# Altium project IMX6ULL开发板.PrjPCB
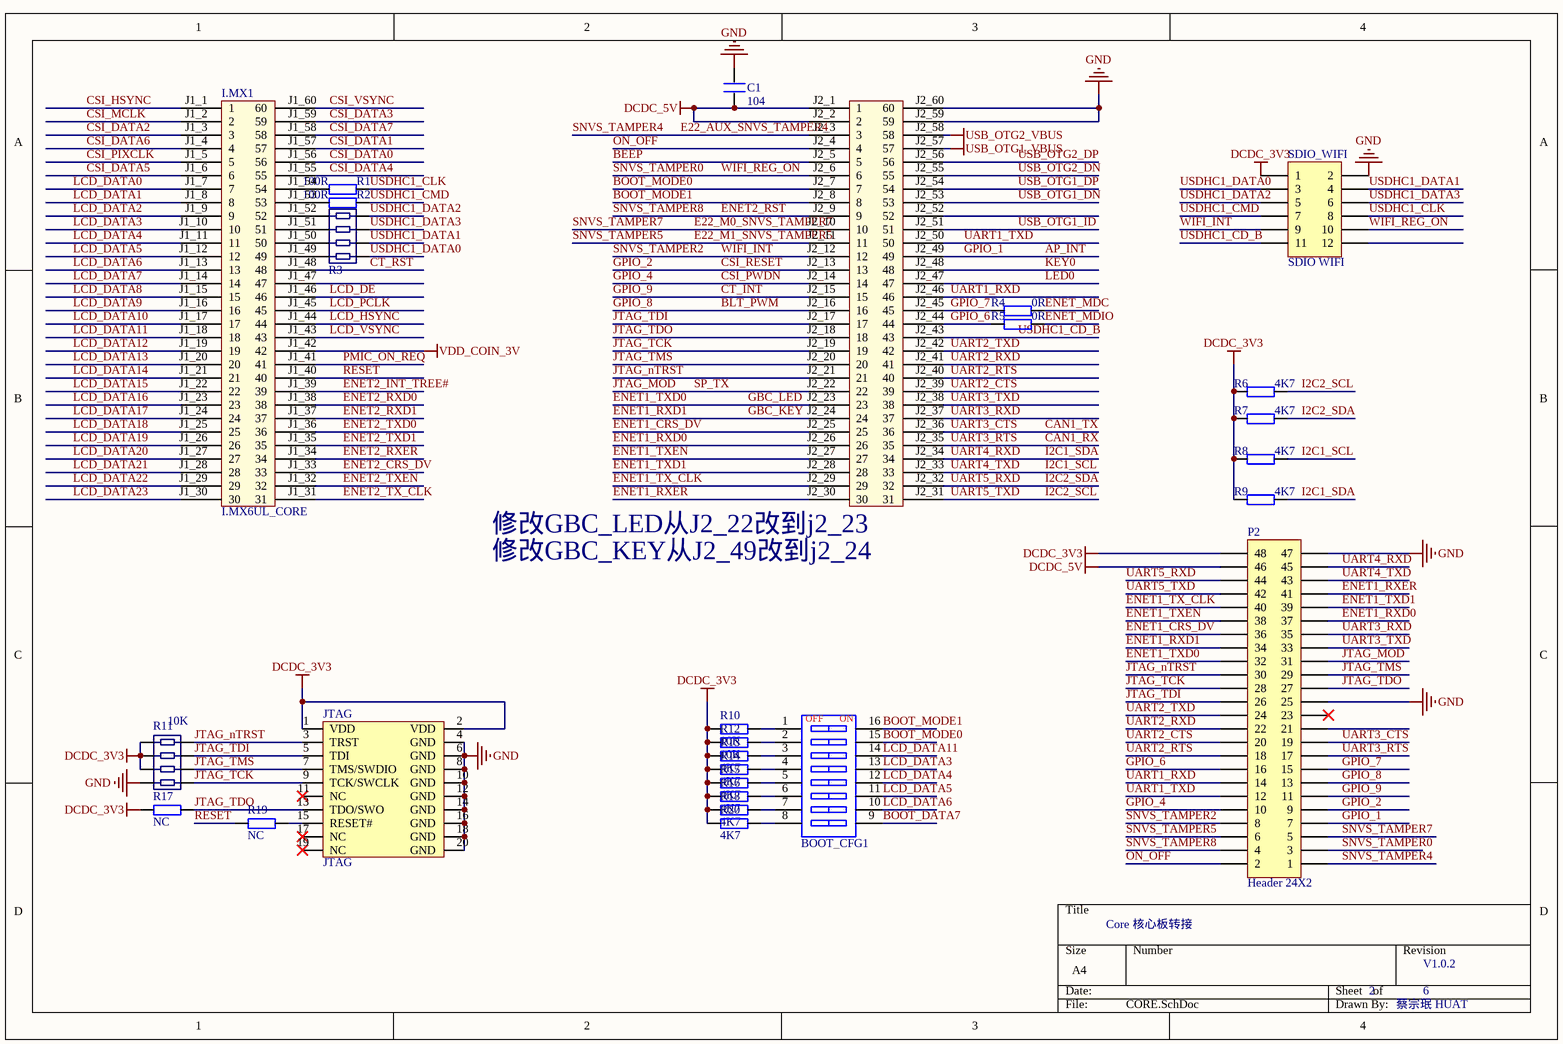
[diagram p0: CORE.SchDoc]
5 sheets, 190 parts. Net scope: global (net labels, ports and power ports of the same name join across sheets).
Board file: imx6ull开发板.PcbDoc
Sheets:
  CORE.SchDoc
  POWER.SchDoc
  DEVICE.SchDoc
  CONNECT.SchDoc
  DEVICE2.SchDoc

## Sheet CORE.SchDoc
size A4

### Parts
BOOT_CFG1  CSW-8P  [CSW DIP-8P]  (value not drawn)
C1  104  [C_0603P]
I.MX1  I.MX6UL_CORE  [I.MX6UL_CORE]
JTAG  JTAG  [JTAG_20]
P2  Header 24X2  [HDR2X24]
R1  100R  [R_0603P]
R2  100R  [R_0603P]
R3  R*4_0603_2  [R*4-0603]  (value not drawn)
R4  0R  [R_0603P]
R5  0R  [R_0603P]
R6  4K7  [R_0603P]
R7  4K7  [R_0603P]
R8  4K7  [R_0603P]
R9  4K7  [R_0603P]
R10  10K  [R_0603P]
R11  10K  [R*4-0603]
R12  10K  [R_0603P]
R13  4K7  [R_0603P]
R14  4K7  [R_0603P]
R15  4K7  [R_0603P]
R16  4K7  [R_0603P]
R17  NC  [R_0603P]
R18  4K7  [R_0603P]
R19  NC  [R_0603P]
R20  4K7  [R_0603P]
SDIO_WIFI  SDIO WIFI  [HDR2X6]

### Nets
DCDC_3V3: JTAG.1(VDD) JTAG.2(VDD) P2.48 R6.1 R7.1 R8.1 R9.1 R10.1 R11.1 R11.3 R11.5 R12.1 R13.1 R14.1 R15.1 R16.1 R17.1 R18.1 R20.1 SDIO_WIFI.1
DCDC_5V: C1.1 I.MX1.J2_1(1) I.MX1.J2_2(2) P2.46
GND: C1.2 I.MX1.J2_59(59) I.MX1.J2_60(60) JTAG.4(GND) JTAG.6(GND) JTAG.8(GND) JTAG.10(GND) JTAG.12(GND) JTAG.14(GND) JTAG.16(GND) JTAG.18(GND) JTAG.20(GND) P2.25 P2.47 R11.7 SDIO_WIFI.2
USB_OTG1_VBUS: I.MX1.J2_57(57)
USB_OTG2_VBUS: I.MX1.J2_58(58)
VDD_COIN_3V: I.MX1.J1_42(42)
AP_INT: I.MX1.J2_49(49) P2.7  [also labelled GPIO_1]
BEEP: I.MX1.J2_5(5)
BLT_PWM: I.MX1.J2_16(16) P2.13  [also labelled GPIO_8]
BOOT_DATA7: BOOT_CFG1.9
BOOT_MODE0: BOOT_CFG1.15 I.MX1.J2_7(7)
BOOT_MODE1: BOOT_CFG1.16 I.MX1.J2_8(8)
CAN1_RX: I.MX1.J2_35(35) P2.17  [also labelled UART3_RTS]
CAN1_TX: I.MX1.J2_36(36) P2.19  [also labelled UART3_CTS]
CSI_DATA0: I.MX1.J1_56(56)
CSI_DATA1: I.MX1.J1_57(57)
CSI_DATA2: I.MX1.J1_3(3)
CSI_DATA3: I.MX1.J1_59(59)
CSI_DATA4: I.MX1.J1_55(55)
CSI_DATA5: I.MX1.J1_6(6)
CSI_DATA6: I.MX1.J1_4(4)
CSI_DATA7: I.MX1.J1_58(58)
CSI_HSYNC: I.MX1.J1_1(1)
CSI_MCLK: I.MX1.J1_2(2)
CSI_PIXCLK: I.MX1.J1_5(5)
CSI_PWDN: I.MX1.J2_14(14) P2.10  [also labelled GPIO_4]
CSI_RESET: I.MX1.J2_13(13) P2.9  [also labelled GPIO_2]
CSI_VSYNC: I.MX1.J1_60(60)
CT_INT: I.MX1.J2_15(15) P2.11  [also labelled GPIO_9]
CT_RST: I.MX1.J1_48(48)
E22_AUX_SNVS_TAMPER4: I.MX1.J2_3(3) P2.1  [also labelled SNVS_TAMPER4]
E22_M0_SNVS_TAMPER7: I.MX1.J2_10(10) P2.5  [also labelled SNVS_TAMPER7]
E22_M1_SNVS_TAMPER5: I.MX1.J2_11(11) P2.6  [also labelled SNVS_TAMPER5]
ENET1_CRS_DV: I.MX1.J2_25(25) P2.36
ENET1_RXD0: I.MX1.J2_26(26) P2.37
ENET1_RXD1: I.MX1.J2_24(24) P2.34  [also labelled GBC_KEY]
ENET1_RXER: I.MX1.J2_30(30) P2.41
ENET1_TX_CLK: I.MX1.J2_29(29) P2.40
ENET1_TXD0: I.MX1.J2_23(23) P2.32  [also labelled GBC_LED]
ENET1_TXD1: I.MX1.J2_28(28) P2.39
ENET1_TXEN: I.MX1.J2_27(27) P2.38
ENET2_CRS_DV: I.MX1.J1_33(33)
ENET2_INT_TREE#: I.MX1.J1_39(39)
ENET2_RST: I.MX1.J2_9(9) P2.4  [also labelled SNVS_TAMPER8]
ENET2_RXD0: I.MX1.J1_38(38)
ENET2_RXD1: I.MX1.J1_37(37)
ENET2_RXER: I.MX1.J1_34(34)
ENET2_TX_CLK: I.MX1.J1_31(31)
ENET2_TXD0: I.MX1.J1_36(36)
ENET2_TXD1: I.MX1.J1_35(35)
ENET2_TXEN: I.MX1.J1_32(32)
ENET_MDC: R4.2
ENET_MDIO: R5.2
GPIO_6: I.MX1.J2_44(44) P2.16 R5.1
GPIO_7: I.MX1.J2_45(45) P2.15 R4.1
I2C1_SCL: I.MX1.J2_33(33) P2.43 R8.2  [also labelled UART4_TXD]
I2C1_SDA: I.MX1.J2_34(34) P2.45 R9.2  [also labelled UART4_RXD]
I2C2_SCL: I.MX1.J2_31(31) P2.42 R6.2  [also labelled UART5_TXD]
I2C2_SDA: I.MX1.J2_32(32) P2.44 R7.2  [also labelled UART5_RXD]
JTAG_MOD: I.MX1.J2_22(22) P2.31  [also labelled SP_TX]
JTAG_nTRST: I.MX1.J2_21(21) JTAG.3(TRST) P2.30 R11.2
JTAG_TCK: I.MX1.J2_19(19) JTAG.9(TCK/SWCLK) P2.28 R11.8
JTAG_TDI: I.MX1.J2_17(17) JTAG.5(TDI) P2.26 R11.4
JTAG_TDO: I.MX1.J2_18(18) JTAG.13(TDO/SWO) P2.27 R17.2
JTAG_TMS: I.MX1.J2_20(20) JTAG.7(TMS/SWDIO) P2.29 R11.6
KEY0: I.MX1.J2_48(48)
LCD_DATA0: I.MX1.J1_7(7)  [project net LCD_B0]
LCD_DATA1: I.MX1.J1_8(8)  [project net LCD_B1]
LCD_DATA2: I.MX1.J1_9(9)  [project net LCD_B2]
LCD_DATA3: BOOT_CFG1.13 I.MX1.J1_10(10)  [project net LCD_B3]
LCD_DATA4: BOOT_CFG1.12 I.MX1.J1_11(11)  [project net LCD_B4]
LCD_DATA5: BOOT_CFG1.11 I.MX1.J1_12(12)  [project net LCD_B5]
LCD_DATA6: BOOT_CFG1.10 I.MX1.J1_13(13)  [project net LCD_B6]
LCD_DATA7: I.MX1.J1_14(14)
LCD_DATA8: I.MX1.J1_15(15)
LCD_DATA9: I.MX1.J1_16(16)
LCD_DATA10: I.MX1.J1_17(17)
LCD_DATA11: BOOT_CFG1.14 I.MX1.J1_18(18)
LCD_DATA12: I.MX1.J1_19(19)
LCD_DATA13: I.MX1.J1_20(20)
LCD_DATA14: I.MX1.J1_21(21)
LCD_DATA15: I.MX1.J1_22(22)
LCD_DATA16: I.MX1.J1_23(23)
LCD_DATA17: I.MX1.J1_24(24)
LCD_DATA18: I.MX1.J1_25(25)
LCD_DATA19: I.MX1.J1_26(26)
LCD_DATA20: I.MX1.J1_27(27)
LCD_DATA21: I.MX1.J1_28(28)
LCD_DATA22: I.MX1.J1_29(29)
LCD_DATA23: I.MX1.J1_30(30)
LCD_DE: I.MX1.J1_46(46)
LCD_HSYNC: I.MX1.J1_44(44)
LCD_PCLK: I.MX1.J1_45(45)
LCD_VSYNC: I.MX1.J1_43(43)
LED0: I.MX1.J2_47(47)
ON_OFF: I.MX1.J2_4(4) P2.2
PMIC_ON_REQ: I.MX1.J1_41(41)
RESET: I.MX1.J1_40(40) R19.1
SNVS_TAMPER0: I.MX1.J2_6(6) P2.3 SDIO_WIFI.10  [also labelled WIFI_REG_ON]
SNVS_TAMPER2: I.MX1.J2_12(12) P2.8 SDIO_WIFI.9  [also labelled WIFI_INT]
UART1_RXD: I.MX1.J2_46(46) P2.14
UART1_TXD: I.MX1.J2_50(50) P2.12
UART2_CTS: I.MX1.J2_39(39) P2.20
UART2_RTS: I.MX1.J2_40(40) P2.18
UART2_RXD: I.MX1.J2_41(41) P2.22
UART2_TXD: I.MX1.J2_42(42) P2.24
UART3_RXD: I.MX1.J2_37(37) P2.35
UART3_TXD: I.MX1.J2_38(38) P2.33
USB_OTG1_DN: I.MX1.J2_53(53)
USB_OTG1_DP: I.MX1.J2_54(54)
USB_OTG1_ID: I.MX1.J2_51(51)
USB_OTG2_DN: I.MX1.J2_55(55)
USB_OTG2_DP: I.MX1.J2_56(56)
USDHC1_CD_B: I.MX1.J2_43(43) SDIO_WIFI.11
USDHC1_CLK: R1.2 SDIO_WIFI.8
USDHC1_CMD: R2.2 SDIO_WIFI.7
USDHC1_DATA0: R3.8 SDIO_WIFI.3
USDHC1_DATA1: R3.6 SDIO_WIFI.4
USDHC1_DATA2: R3.2 SDIO_WIFI.5
USDHC1_DATA3: R3.4 SDIO_WIFI.6
NetBOOT_CFG1_1: BOOT_CFG1.1 R10.2
NetBOOT_CFG1_2: BOOT_CFG1.2 R12.2
NetBOOT_CFG1_3: BOOT_CFG1.3 R13.2
NetBOOT_CFG1_4: BOOT_CFG1.4 R14.2
NetBOOT_CFG1_5: BOOT_CFG1.5 R15.2
NetBOOT_CFG1_6: BOOT_CFG1.6 R16.2
NetBOOT_CFG1_7: BOOT_CFG1.7 R18.2
NetBOOT_CFG1_8: BOOT_CFG1.8 R20.2
NetI.MX1_J1_49: I.MX1.J1_49(49) R3.7
NetI.MX1_J1_50: I.MX1.J1_50(50) R3.5
NetI.MX1_J1_51: I.MX1.J1_51(51) R3.3
NetI.MX1_J1_52: I.MX1.J1_52(52) R3.1
NetI.MX1_J1_53: I.MX1.J1_53(53) R2.1
NetI.MX1_J1_54: I.MX1.J1_54(54) R1.1
NetJTAG_15: JTAG.15(RESET#) R19.2

Not connected (* = marked no-connect by the designer): I.MX1 J1_47(47) J2_52(52); JTAG 11(NC)* 17(NC)* 19(NC)*; P2 21 23*; SDIO_WIFI 12

### Notes on the sheet
- (near I.MX1) 修改GBC_LED从J2_22改到j2_23
- (near I.MX1) 修改GBC_KEY从J2_49改到j2_24
- Core 核心板转接
- 2
- 6
- V1.0.2
- 蔡宗珉 HUAT
- (in symbol CSW-8P) OFF; ON

### Library data of the parts
BOOT_CFG1 = CSW-8P: 8路编码开关; 版权归属: 源创客; BOM名称: 8路编码开关; 学习资源: www.ooocke.com
C1 = C
I.MX1 = I.MX6UL核心板
P2 = Header 24X2: Header, 24-Pin, Dual row; LatestRevisionDate: 17-Jul-2002; LatestRevisionNote: Re-released for DXP Platform.; Publisher: Altium Limited
R1 R2 R4-R10 R12-R20 = R
R11 = R*4_0603_2
SDIO_WIFI = Header 6X2: Header, 6-Pin, Dual row; LatestRevisionDate: 17-Jul-2002; LatestRevisionNote: Re-released for DXP Platform.; Publisher: Altium Limited

## Sheet POWER.SchDoc
size A4
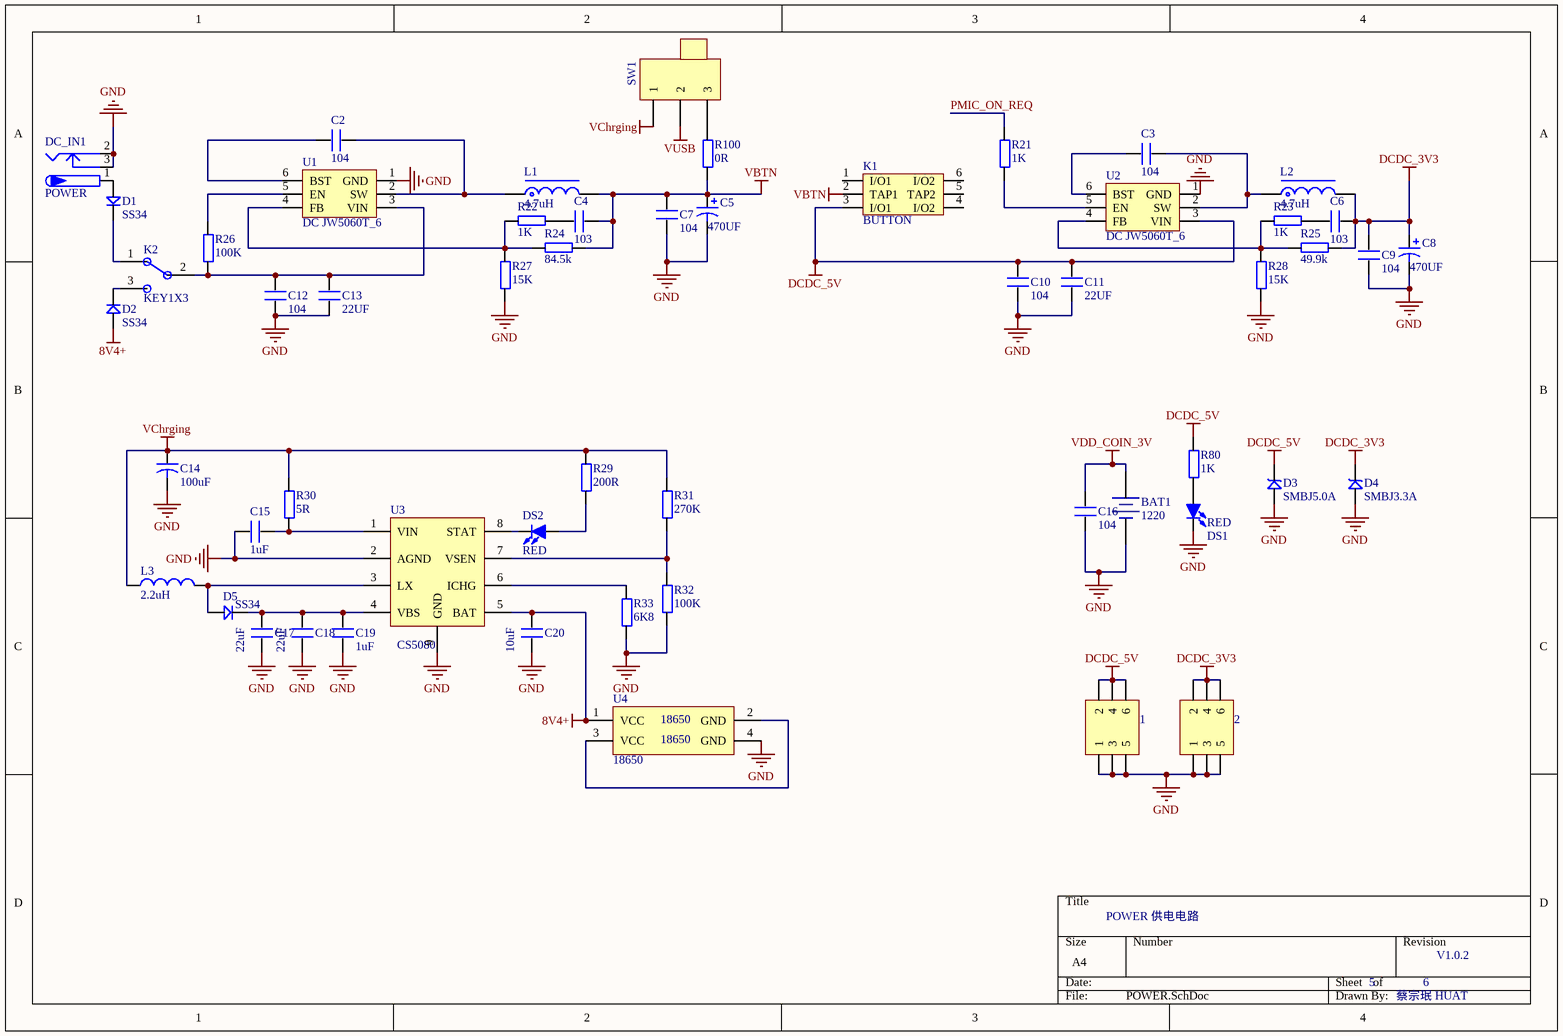
[diagram p1: POWER.SchDoc]

### Parts
1  RS232/RS485  [HDR-3X2]  (value not drawn)
2  RS232/RS485  [HDR-3X2]  (value not drawn)
BAT1  1220  [CR1220_B]
C2  104  [C_0603P]
C3  104  [C_0603P]
C4  103  [C_0603P]
C5  value 470UF  [CAP2.54M]  (hidden comment: Cap Pol1)
C6  103  [C_0603P]
C7  104  [C_0603P]
C8  value 470UF  [CAP2.54M]  (hidden comment: Cap Pol1)
C9  104  [C_0603P]
C10  104  [C_0603P]
C11  22UF  [C_0603P]
C12  104  [C_0603P]
C13  22UF  [C_0603P]
C14  value 100uF  [CAP2.54M]  (hidden comment: Cap2)
C15  1uF  [C_0603P]
C16  104  [C_0603P]
C17  22uF  [C_0603P]
C18  22uF  [C_0603P]
C19  1uF  [C_0603P]
C20  10uF  [C_0805]
D1  SS34  [DIODE 3*5.3]
D2  SS34  [DIODE 3*5.3]
D3  SMBJ5.0A  [SMBJ]
D4  SMBJ3.3A  [SMBJ]
D5  SS34  [DIODE 3*5.3]
DC_IN1  POWER  [DC10B]
DS1  RED  [LED 0805R]
DS2  RED  [LED 0805R]
K1  BUTTON  [BTN8.5*8.5]
K2  KEY1X3  [PKEY]
L1  4.7uH  [L-SMD-0420]
L2  4.7uH  [L-SMD-0420]
L3  2.2uH  [CD74 电感   7*7*4mm贴片]
R21  1K  [R_0603P]
R22  1K  [R_0603P]
R23  1K  [R_0603P]
R24  84.5k  [R_0603P]
R25  49.9k  [R_0603P]
R26  100K  [R_0603P]
R27  15K  [R_0603P]
R28  15K  [R_0603P]
R29  200R  [R_0603P]
R30  5R  [R_0805]
R31  270K  [R_0603P]
R32  100K  [R_0603P]
R33  6K8  [R_0603P]
R80  1K  [R_0603P]
R100  0R  [R_0805]
SW1  switch  [三脚拨动开关SS12D00G4]  (value not drawn)
U1  DC JW5060T_6  [SOT23-6N]
U2  DC JW5060T_6  [SOT23-6N]
U3  CS5080  [ESOP8   IP5306]
U4  18650  [18650 2节电池座 PCB插脚]

### Nets
8V4+: C20.2 D2.1 U3.5(BAT) U4.1(VCC)
DCDC_3V3: 2.2 2.4 2.6 C6.1 C8.1 C9.2 D4.2 L2.2 R25.1
DCDC_5V: 1.2 1.4 1.6 C10.2 C11.2 D3.2 K1.3(I/O1) R80.2 U2.3(VIN)
GND: 1.1 1.3 1.5 2.1 2.3 2.5 BAT1.2(DC-) C5.2 C7.1 C8.2 C9.1 C10.1 C11.1 C12.1 C13.1 C14.2 C15.1 C16.1 C17.1 C18.1 C19.1 C20.1 D3.1 D4.1 DC_IN1.2 DC_IN1.3 DS1.2(K) R27.1 R28.1 R32.1 R33.1 U1.1(GND) U2.1(GND) U3.2(AGND) U3.9(GND) U4.4(GND)
VBTN: C4.1 C5.1 C7.2 K1.2(TAP1) L1.2 R24.1 R100.1
VChrging: C14.1 L3.1 R29.2 R30.2 R31.2 SW1.1
VDD_COIN_3V: BAT1.1(DC+) C16.2
VUSB: SW1.2
PMIC_ON_REQ: R21.2
NetC2_1: C2.1 U1.6(BST)
NetC2_2: C2.2 L1.1 U1.2(SW)
NetC3_1: C3.1 U2.6(BST)
NetC3_2: C3.2 L2.1 U2.2(SW)
NetC4_2: C4.2 R22.1
NetC6_2: C6.2 R23.1
NetC12_2: C12.2 C13.2 K2.2 R26.1 U1.3(VIN)
NetC15_2: C15.2 R30.1 U3.1(VIN)
NetC17_2: C17.2 C18.2 C19.2 D5.2 U3.4(VBS)
NetD1_1: D1.1 DC_IN1.1
NetD1_2: D1.2 K2.1
NetD2_2: D2.2 K2.3
NetD5_1: D5.1 L3.2 U3.3(LX)
NetDS1_1: DS1.1(A) R80.1
NetDS2_1: DS2.1(A) R29.1
NetDS2_2: DS2.2(K) U3.8(STAT)
NetR21_1: R21.1 U2.5(EN)
NetR22_2: R22.2 R24.2 R27.2 U1.4(FB)
NetR23_2: R23.2 R25.2 R28.2 U2.4(FB)
NetR26_2: R26.2 U1.5(EN)
NetR31_1: R31.1 R32.2 U3.7(VSEN)
NetR33_2: R33.2 U3.6(ICHG)
NetR100_2: R100.2 SW1.3
NetU4_2: U4.2(GND) U4.3(VCC)

Not connected (* = marked no-connect by the designer): K1 1(I/O1) 4(I/O2) 5(TAP2) 6(I/O2)

### Notes on the sheet
- POWER 供电电路
- 5
- 6
- V1.0.2
- 蔡宗珉 HUAT

### Library data of the parts
1 2 = Header 3X2: 3*2P接插件; 版权归属: 源创客; BOM名称: 3*2P接插件; 学习资源: www.ooocke.com
BAT1 = CR-3V: 微型电池; 版权归属: 源创客; BOM名称: 微型电池; 学习资源: www.ooocke.com
C2-C4 C6 C7 C9-C13 C15-C20 = C
C5 C8 = Cap Pol1: Polarized Capacitor (Radial); Published: 8-Jun-2000; LatestRevisionDate: 17-Jul-2002; LatestRevisionNote: Re-released for DXP Platform.; PackageReference: RB7.6-15; Publisher: Altium Limited; PackageDescription: Polarized Capacitor (Radial); 2 Leads
C14 = Cap2: Capacitor; Published: 23-Sep-2002; PackageReference: CAPR5-4X5; Publisher: Altium Limited; PackageDescription: Capacitor; 2 Leads
D1 D2 D5 = D: 1N4148
D3 D4 = SMBJ: TVS
DC_IN1 = P-DC: 低压电源接口; BOM名称: DC电源接口; 版权归属: 源创客; 学习资源: www.ooocke.com
DS1 DS2 = LED-SMD: 贴片LED; 版权归属: 源创客; BOM名称: 贴片LED; 学习资源: www.ooocke.com
K2 = PKEY
L1 L2 = L-CDRH: 功率屏蔽电感; 版权归属: 源创客; BOM名称: 功率屏蔽电感; 学习资源: www.ooocke.com
L3 = Inductor: Code_IEC: 1005; Published: 8-Jun-2000; LatestRevisionDate: 17-Jul-2002; LatestRevisionNote: Re-released for DXP Platform.; PackageReference: 0402-A; Publisher: Altium Limited; Code_JEITA: 0402
R21-R33 R80 R100 = R
SW1 = 3脚拔动开关
U1 U2 = DC JW5060T_6: DC降压芯片
U3 = CS5080 5V输入8V4输出充电器IC: 5V输入8V4输出充电器IC
U4 = 18650 2节电池座 PCB插脚

## Sheet DEVICE.SchDoc
size A4
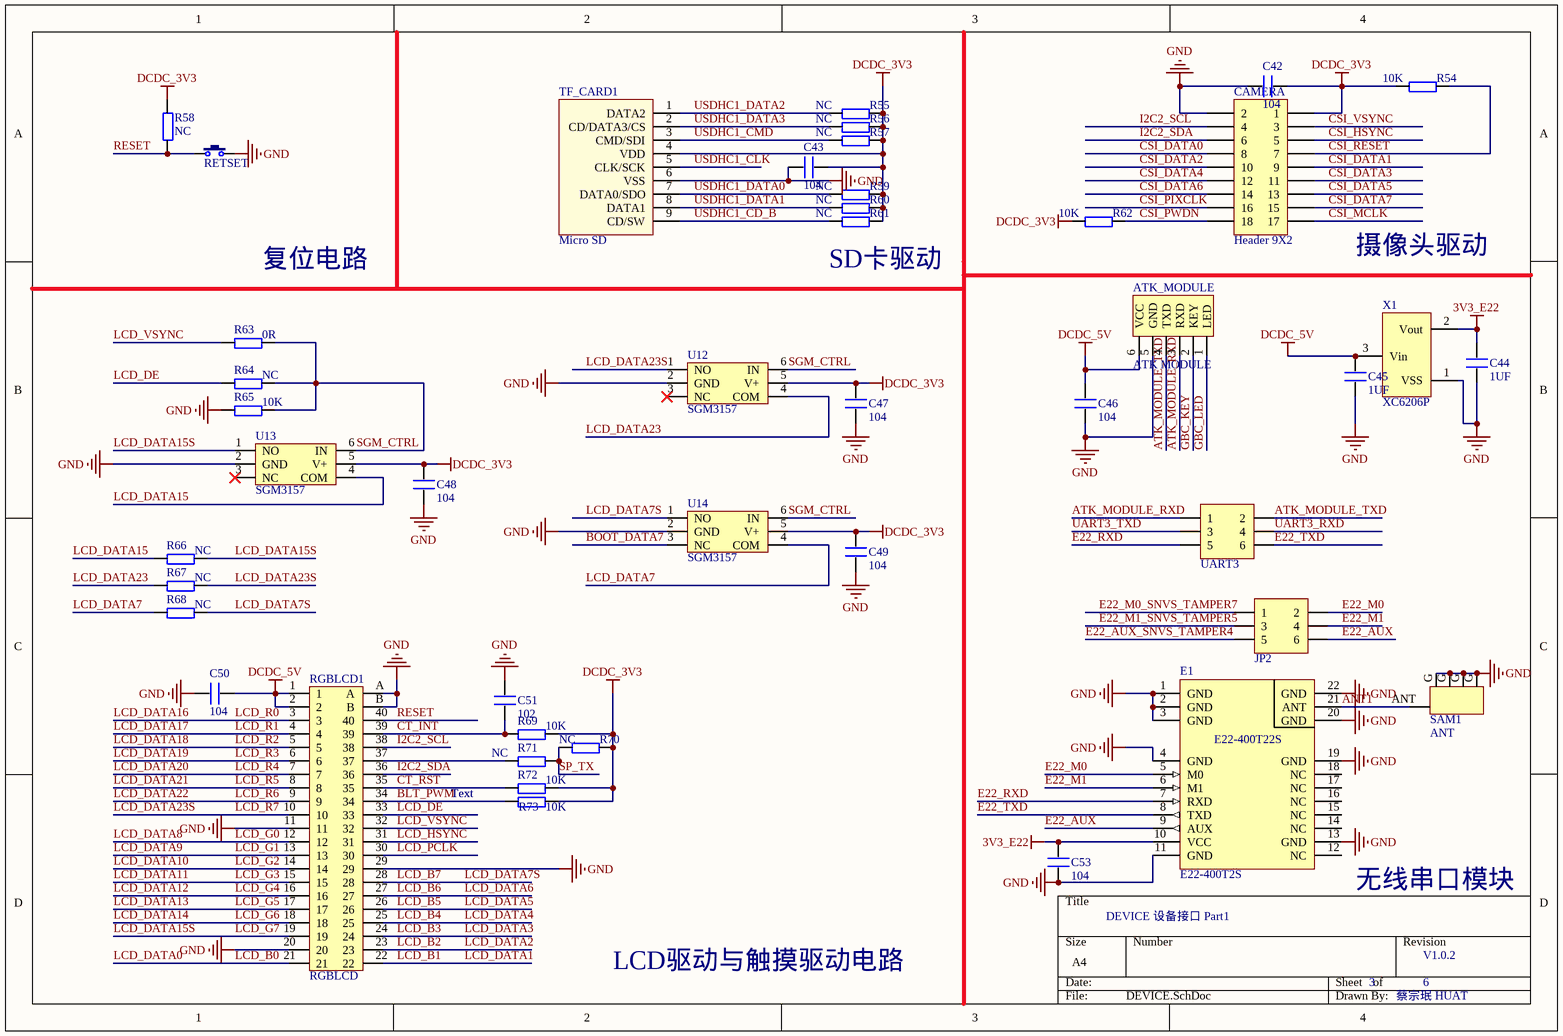
[diagram p2: DEVICE.SchDoc]

### Parts
ATK_MODULE  ATK MODULE  [HEAD6]
C42  104  [C_0603P]
C43  104  [C_0603P]
C44  1UF  [C_0603P]
C45  1UF  [C_0603P]
C46  104  [C_0603P]
C47  104  [C_0603P]
C48  104  [C_0603P]
C49  104  [C_0603P]
C50  104  [C_0603P]
C51  102  [C_0603P]
C53  104  [C_0603P]
CAMERA  Header 9X2  [HDR2X9]
E1  E22-400T2S  [PE22-400T22S]
JP2  RS232/RS485  [HDR-3X2]  (value not drawn)
R54  10K  [R_0603P]
R55  NC  [R_0603P]
R56  NC  [R_0603P]
R57  NC  [R_0603P]
R58  NC  [R_0603P]
R59  NC  [R_0603P]
R60  NC  [R_0603P]
R61  NC  [R_0603P]
R62  10K  [R_0603P]
R63  0R  [R_0603P]
R64  NC  [R_0603P]
R65  10K  [R_0603P]
R66  NC  [R_0603P]
R67  NC  [R_0603P]
R68  NC  [R_0603P]
R69  10K  [R_0603P]
R70  NC  [R_0603P]
R71  NC  [R_0603P]
R72  10K  [R_0603P]
R73  10K  [R_0603P]
RETSET  KEY  [TSW DIP-6*6*5 - 2]  (value not drawn)
RGBLCD1  RGBLCD  [FPC0.5-TOP40P]
SAM1  ANT  [SMA-KE]
TF_CARD1  Micro SD  [Micro SD]
U12  SGM3157  [SOT363-6L]
U13  SGM3157  [SOT363-6L]
U14  SGM3157  [SOT363-6L]
UART3  RS232/RS485  [HDR-3X2]  (value not drawn)
X1  XC6206P  [XC6206P332  SOT-23  LDO电源稳压IC]

### Nets
3V3_E22: C44.2 C53.2 E1.10(VCC) X1.2(Vout)
DCDC_3V3: C42.2 C43.2 C47.2 C48.2 C49.2 CAMERA.1 R54.1 R55.2 R56.2 R57.2 R58.2 R59.2 R60.2 R61.2 R62.1 R69.2 R70.2 R72.2 R73.2 TF_CARD1.4(VDD) U12.5(V+) U13.5(V+) U14.5(V+)
DCDC_5V: ATK_MODULE.6(VCC) C45.2 C46.2 C50.2 RGBLCD1.1 RGBLCD1.2 X1.3(Vin)
GND: ATK_MODULE.5(GND) C42.1 C43.1 C44.1 C45.1 C46.1 C47.1 C48.1 C49.1 C50.1 C51.2 C53.1 CAMERA.2 E1.1(GND) E1.2(GND) E1.3(GND) E1.4(GND) E1.11(GND) E1.13(GND) E1.19(GND) E1.20(GND) E1.22(GND) R65.1 RETSET.2 RGBLCD1.11 RGBLCD1.20 RGBLCD1.29 RGBLCD1.A RGBLCD1.B SAM1.G TF_CARD1.6(VSS) U12.2(GND) U13.2(GND) U14.2(GND) X1.1(VSS)
ANT1: E1.21(ANT) SAM1.ANT
ATK_MODULE_RXD: ATK_MODULE.3(RXD) UART3.1
ATK_MODULE_TXD: ATK_MODULE.4(TXD) UART3.2
BLT_PWM: R73.1 RGBLCD1.34
BOOT_DATA7: U14.3(NC)
CSI_DATA0: CAMERA.8
CSI_DATA1: CAMERA.9
CSI_DATA2: CAMERA.10
CSI_DATA3: CAMERA.11
CSI_DATA4: CAMERA.12
CSI_DATA5: CAMERA.13
CSI_DATA6: CAMERA.14
CSI_DATA7: CAMERA.15
CSI_HSYNC: CAMERA.5
CSI_MCLK: CAMERA.17
CSI_PIXCLK: CAMERA.16
CSI_PWDN: CAMERA.18 R62.2
CSI_RESET: CAMERA.7 R54.2
CSI_VSYNC: CAMERA.3
CT_INT: C51.1 R69.1 RGBLCD1.39
CT_RST: R72.1 RGBLCD1.35
E22_AUX: E1.9(AUX) JP2.6
E22_AUX_SNVS_TAMPER4: JP2.5
E22_M0: E1.5(M0) JP2.2
E22_M0_SNVS_TAMPER7: JP2.1
E22_M1: E1.6(M1) JP2.4
E22_M1_SNVS_TAMPER5: JP2.3
E22_RXD: E1.7(RXD) UART3.5
E22_TXD: E1.8(TXD) UART3.6
GBC_KEY: ATK_MODULE.2(KEY)  [project net ENET1_RXD1]
GBC_LED: ATK_MODULE.1(LED)  [project net ENET1_TXD0]
I2C2_SCL: CAMERA.4 RGBLCD1.38
I2C2_SDA: CAMERA.6 RGBLCD1.36
LCD_B0: RGBLCD1.21  [also labelled LCD_DATA0]
LCD_B1: RGBLCD1.22  [also labelled LCD_DATA1]
LCD_B2: RGBLCD1.23  [also labelled LCD_DATA2]
LCD_B3: RGBLCD1.24  [also labelled LCD_DATA3]
LCD_B4: RGBLCD1.25  [also labelled LCD_DATA4]
LCD_B5: RGBLCD1.26  [also labelled LCD_DATA5]
LCD_B6: RGBLCD1.27  [also labelled LCD_DATA6]
LCD_B7: R68.2 RGBLCD1.28 U14.1(NO)  [also labelled LCD_DATA7S]
LCD_DATA7: R68.1 U14.4(COM)
LCD_DATA8: RGBLCD1.12  [also labelled LCD_G0]
LCD_DATA9: RGBLCD1.13  [also labelled LCD_G1]
LCD_DATA10: RGBLCD1.14  [also labelled LCD_G2]
LCD_DATA11: RGBLCD1.15  [also labelled LCD_G3]
LCD_DATA12: RGBLCD1.16  [also labelled LCD_G4]
LCD_DATA13: RGBLCD1.17  [also labelled LCD_G5]
LCD_DATA14: RGBLCD1.18  [also labelled LCD_G6]
LCD_DATA15: R66.1 U13.4(COM)
LCD_DATA15S: R66.2 RGBLCD1.19 U13.1(NO)  [also labelled LCD_G7]
LCD_DATA16: RGBLCD1.3  [also labelled LCD_R0]
LCD_DATA17: RGBLCD1.4  [also labelled LCD_R1]
LCD_DATA18: RGBLCD1.5  [also labelled LCD_R2]
LCD_DATA19: RGBLCD1.6  [also labelled LCD_R3]
LCD_DATA20: RGBLCD1.7  [also labelled LCD_R4]
LCD_DATA21: RGBLCD1.8  [also labelled LCD_R5]
LCD_DATA22: RGBLCD1.9  [also labelled LCD_R6]
LCD_DATA23: R67.1 U12.4(COM)
LCD_DATA23S: R67.2 RGBLCD1.10 U12.1(NO)  [also labelled LCD_R7]
LCD_DE: R64.1 RGBLCD1.33
LCD_HSYNC: RGBLCD1.31
LCD_PCLK: RGBLCD1.30
LCD_VSYNC: R63.1 RGBLCD1.32
RESET: R58.1 RETSET.1 RGBLCD1.40
SGM_CTRL: R63.2 R64.2 R65.2 U12.6(IN) U13.6(IN) U14.6(IN)
SP_TX: R70.1 R71.2  [project net JTAG_MOD]
UART3_RXD: UART3.4
UART3_TXD: UART3.3
USDHC1_CD_B: R61.1 TF_CARD1.9(CD/SW)
USDHC1_CLK: TF_CARD1.5(CLK/SCK)
USDHC1_CMD: R57.1 TF_CARD1.3(CMD/SDI)
USDHC1_DATA0: R59.1 TF_CARD1.7(DATA0/SDO)
USDHC1_DATA1: R60.1 TF_CARD1.8(DATA1)
USDHC1_DATA2: R55.1 TF_CARD1.1(DATA2)
USDHC1_DATA3: R56.1 TF_CARD1.2(CD/DATA3/CS)
NetR71_1: R71.1 RGBLCD1.37

Not connected (* = marked no-connect by the designer): E1 12(NC) 14(NC) 15(NC) 16(NC) 17(NC) 18(NC); U12 3(NC)*; U13 3(NC)*

### Notes on the sheet
- 复位电路
- SD卡驱动
- 摄像头驱动
- Text
- DEVICE 设备接口 Part1
- (near E1) 无线串口模块
- LCD驱动与触摸驱动电路
- 3
- 6
- V1.0.2
- 蔡宗珉 HUAT
- (in symbol E22-400T2S) E22-400T22S

### Library data of the parts
ATK_MODULE = ATK-HC05
C42-C51 C53 = C
CAMERA = Header 9X2: Header, 9-Pin, Dual row; LatestRevisionDate: 17-Jul-2002; LatestRevisionNote: Re-released for DXP Platform.; Publisher: Altium Limited
JP2 UART3 = Header 3X2: 3*2P接插件; 版权归属: 源创客; BOM名称: 3*2P接插件; 学习资源: www.ooocke.com
R54-R73 = R
RETSET = KEY: 按键; BOM名称: 3x6轻触开关; 版权归属: 源创客; 学习资源: www.ooocke.com
RGBLCD1 = FPC-40: FPC-40P-0.5mm
SAM1 = SAM-DIP 天线座
TF_CARD1 = Micro SD: Micro SD卡; 版权归属: 源创客; BOM名称: Micro SD卡; 学习资源: www.ooocke.com
U12-U14 = SGM3157: 单路双掷模拟开关
X1 = XC6206P-332 稳压LDO芯片

## Sheet CONNECT.SchDoc
size A4
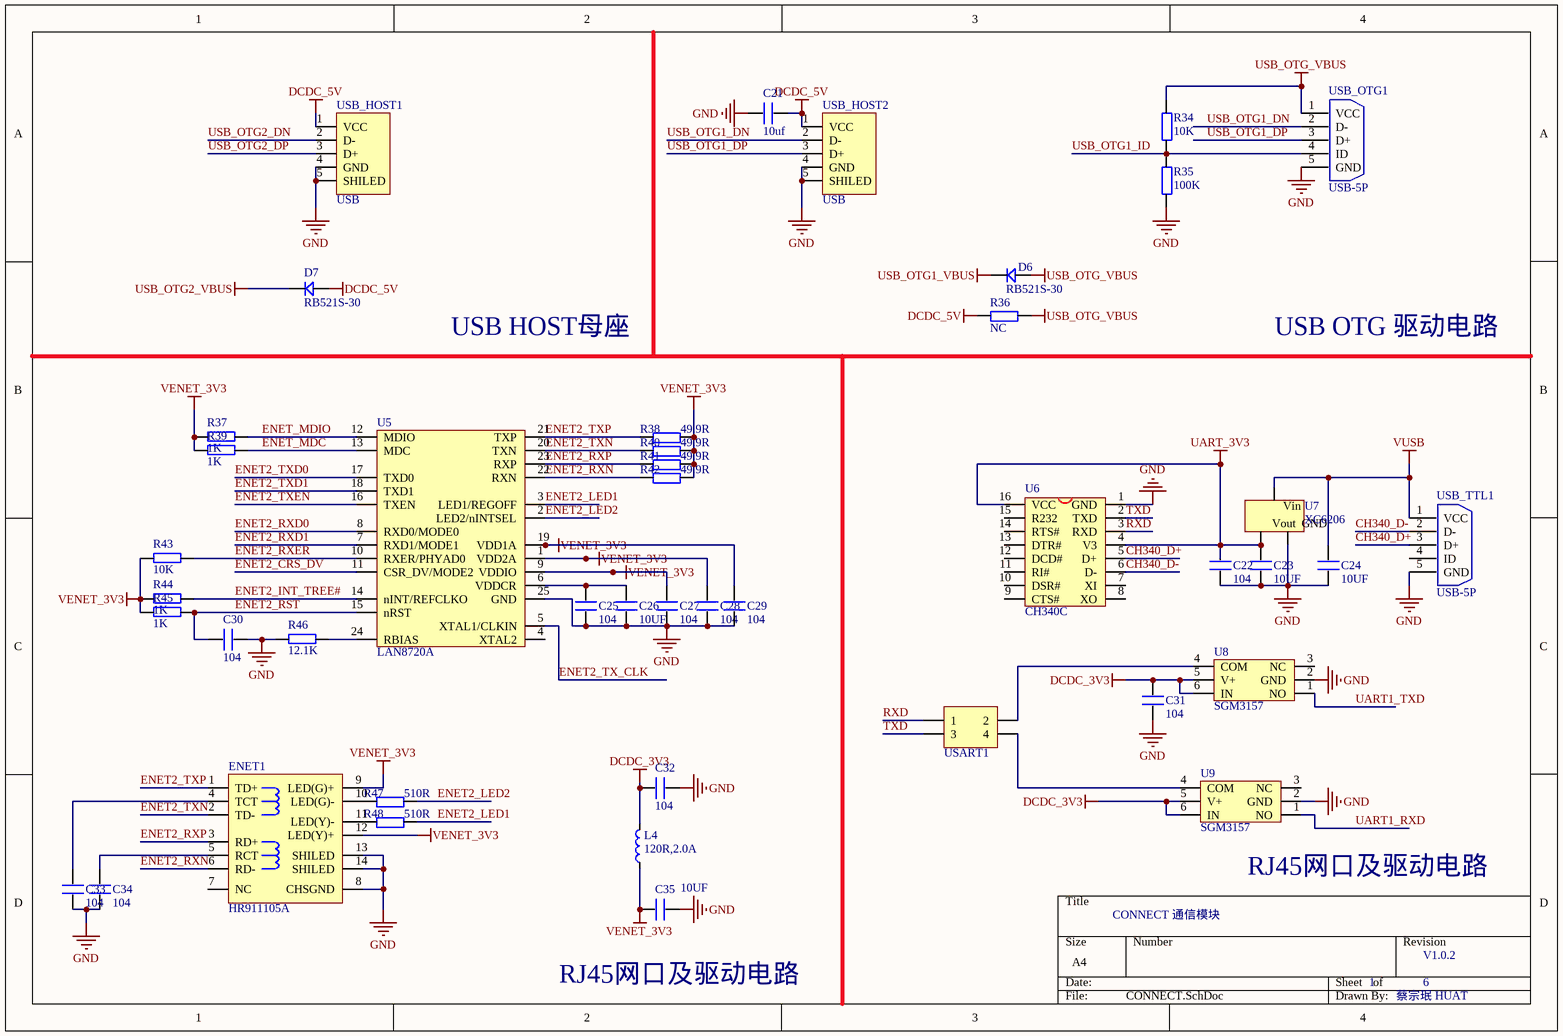
[diagram p3: CONNECT.SchDoc]

### Parts
C21  10uf  [C_0603P]
C22  104  [C_0603P]
C23  10UF  [C_0603P]
C24  10UF  [C_0603P]
C25  104  [C_0603P]
C26  10UF  [C_0603P]
C27  104  [C_0603P]
C28  104  [C_0603P]
C29  104  [C_0603P]
C30  104  [C_0603P]
C31  104  [C_0603P]
C32  104  [C_0603P]
C33  104  [C_0603P]
C34  104  [C_0603P]
C35  10UF  [C_0603P]
D6  RB521S-30  [DIODE 3*5.3]
D7  RB521S-30  [DIODE 3*5.3]
ENET1  HR911105A  [RJ-45A12]
L4  120R,2.0A  [L 0603]
R34  10K  [R_0603P]
R35  100K  [R_0603P]
R36  NC  [R_0603P]
R37  1K  [R_0603P]
R38  49.9R  [R_0603P]
R39  1K  [R_0603P]
R40  49.9R  [R_0603P]
R41  49.9R  [R_0603P]
R42  49.9R  [R_0603P]
R43  10K  [R_0603P]
R44  1K  [R_0603P]
R45  1K  [R_0603P]
R46  12.1K  [R_0603P]
R47  510R  [R_0603P]
R48  510R  [R_0603P]
U5  LAN8720A  [QFN24]
U6  CH340C  [SOP16_N]
U7  XC6206  [SOT23-3N]
U8  SGM3157  [SOT363-6L]
U9  SGM3157  [SOT363-6L]
USART1  Header2X2  [HDR-2X2]  (value not drawn)
USB_HOST1  USB  [USB-A/S_E]
USB_HOST2  USB  [USB-A/S_E]
USB_OTG1  USB-5P  [USB-MINI-A]
USB_TTL1  USB-5P  [USB-MINI-A]

### Nets
DCDC_3V3: C31.2 C32.2 L4.2 U8.5(V+) U8.6(IN) U9.5(V+) U9.6(IN)
DCDC_5V: C21.2 D7.1 R36.1 USB_HOST1.1(VCC) USB_HOST2.1(VCC)
GND: C21.1 C22.1 C23.1 C24.1 C25.1 C26.1 C27.1 C28.1 C29.1 C30.1 C31.1 C32.1 C33.1 C34.1 C35.1 ENET1.8(CHSGND) ENET1.13(SHILED) ENET1.14(SHILED) R35.1 R46.2 U5.25(GND) U6.1(GND) U7.1(GND) U8.2(GND) U9.2(GND) USB_HOST1.4(GND) USB_HOST1.5(SHILED) USB_HOST2.4(GND) USB_HOST2.5(SHILED) USB_OTG1.5(GND) USB_TTL1.5(GND)
UART_3V3: C22.2 C23.2 U6.4(V3) U6.16(VCC) U7.2(Vout)
USB_OTG1_VBUS: D6.2
USB_OTG2_VBUS: D7.2
USB_OTG_VBUS: D6.1 R34.2 R36.2 USB_OTG1.1(VCC)
VENET_3V3: C27.2 C28.2 C29.2 C35.2 ENET1.9(LED(G)+) ENET1.12(LED(Y)+) L4.1 R37.2 R38.2 R39.2 R40.2 R41.2 R42.2 R43.2 R44.2 R45.2 U5.1(VDD2A) U5.9(VDDIO) U5.19(VDD1A)
VUSB: C24.2 U7.3(Vin) USB_TTL1.1(VCC)
CH340_D+: U6.5(D+) USB_TTL1.3(D+)
CH340_D-: U6.6(D-) USB_TTL1.2(D-)
ENET2_CRS_DV: U5.11(CSR_DV/MODE2)
ENET2_INT_TREE#: R44.1 U5.14(nINT/REFCLKO)
ENET2_LED1: R48.2 U5.3(LED1/REGOFF)
ENET2_LED2: R47.2 U5.2(LED2/nINTSEL)
ENET2_RST: C30.2 R45.1 U5.15(nRST)
ENET2_RXD0: U5.8(RXD0/MODE0)
ENET2_RXD1: U5.7(RXD1/MODE1)
ENET2_RXER: R43.1 U5.10(RXER/PHYAD0)
ENET2_RXN: ENET1.6(RD-) R42.1 U5.22(RXN)
ENET2_RXP: ENET1.3(RD+) R41.1 U5.23(RXP)
ENET2_TX_CLK: U5.5(XTAL1/CLKIN)
ENET2_TXD0: U5.17(TXD0)
ENET2_TXD1: U5.18(TXD1)
ENET2_TXEN: U5.16(TXEN)
ENET2_TXN: ENET1.2(TD-) R40.1 U5.20(TXN)
ENET2_TXP: ENET1.1(TD+) R38.1 U5.21(TXP)
ENET_MDC: R39.1 U5.13(MDC)
ENET_MDIO: R37.1 U5.12(MDIO)
RXD: U6.3(RXD) USART1.1
TXD: U6.2(TXD) USART1.3
UART1_RXD: U9.1(NO)
UART1_TXD: U8.1(NO)
USB_OTG1_DN: USB_HOST2.2(D-) USB_OTG1.2(D-)
USB_OTG1_DP: USB_HOST2.3(D+) USB_OTG1.3(D+)
USB_OTG1_ID: R34.1 R35.2 USB_OTG1.4(ID)
USB_OTG2_DN: USB_HOST1.2(D-)
USB_OTG2_DP: USB_HOST1.3(D+)
NetC25_2: C25.2 C26.2 U5.6(VDDCR)
NetC33_2: C33.2 ENET1.4(TCT)
NetC34_2: C34.2 ENET1.5(RCT)
NetENET1_10: ENET1.10(LED(G)-) R47.1
NetENET1_11: ENET1.11(LED(Y)-) R48.1
NetR46_1: R46.1 U5.24(RBIAS)
NetU8_4: U8.4(COM) USART1.2
NetU9_4: U9.4(COM) USART1.4

Not connected (* = marked no-connect by the designer): ENET1 7(NC); U5 4(XTAL2); U6 7(XI) 8(XO) 9(CTS#) 10(DSR#) 11(RI#) 12(DCD#) 13(DTR#) 14(RTS#) 15(R232); U8 3(NC); U9 3(NC); USB_TTL1 4(ID)

### Notes on the sheet
- USB HOST母座
- USB OTG 驱动电路
- CONNECT 通信模块
- (near U9) RJ45网口及驱动电路
- (near C35) RJ45网口及驱动电路
- 1
- 6
- V1.0.2
- 蔡宗珉 HUAT

### Library data of the parts
C21-C35 = C
D6 D7 = D: 1N4148
ENET1 = HR911105A: 带灯以太网接口; 版权归属: 源创客; BOM名称: 带灯以太网接口; 学习资源: www.ooocke.com
L4 = L: 小功率贴片电感磁珠; 版权归属: 源创客; BOM名称: 小功率贴片电感; 学习资源: www.ooocke.com
R34-R48 = R
U5 = LAN8720: ETH PHY
U6 = CH340G: USB2UART
U7 = LDO XC6206: LDO; ComponentLink1Description: 供应商链接; ComponentLink1URL: http://www.szlcsc.com/product/details_5896.html; Package: SOT-23; Supplier: LC; SuppliersPartNumber: C5446
U8 U9 = SGM3157: 单路双掷模拟开关
USART1 = Header 2X2: 2*2P接插件; 版权归属: 源创客; BOM名称: 2*2P接插件; 学习资源: www.ooocke.com
USB_HOST1 USB_HOST2 = USB-A/S: USB-A型母接口; 版权归属: 源创客; BOM名称: USB-A型母接口; 学习资源: www.ooocke.com
USB_OTG1 USB_TTL1 = USB-5P: 微型USB母座; 版权归属: 源创客; BOM名称: 微型USB母座; 学习资源: www.ooocke.com

## Sheet DEVICE2.SchDoc
size A4
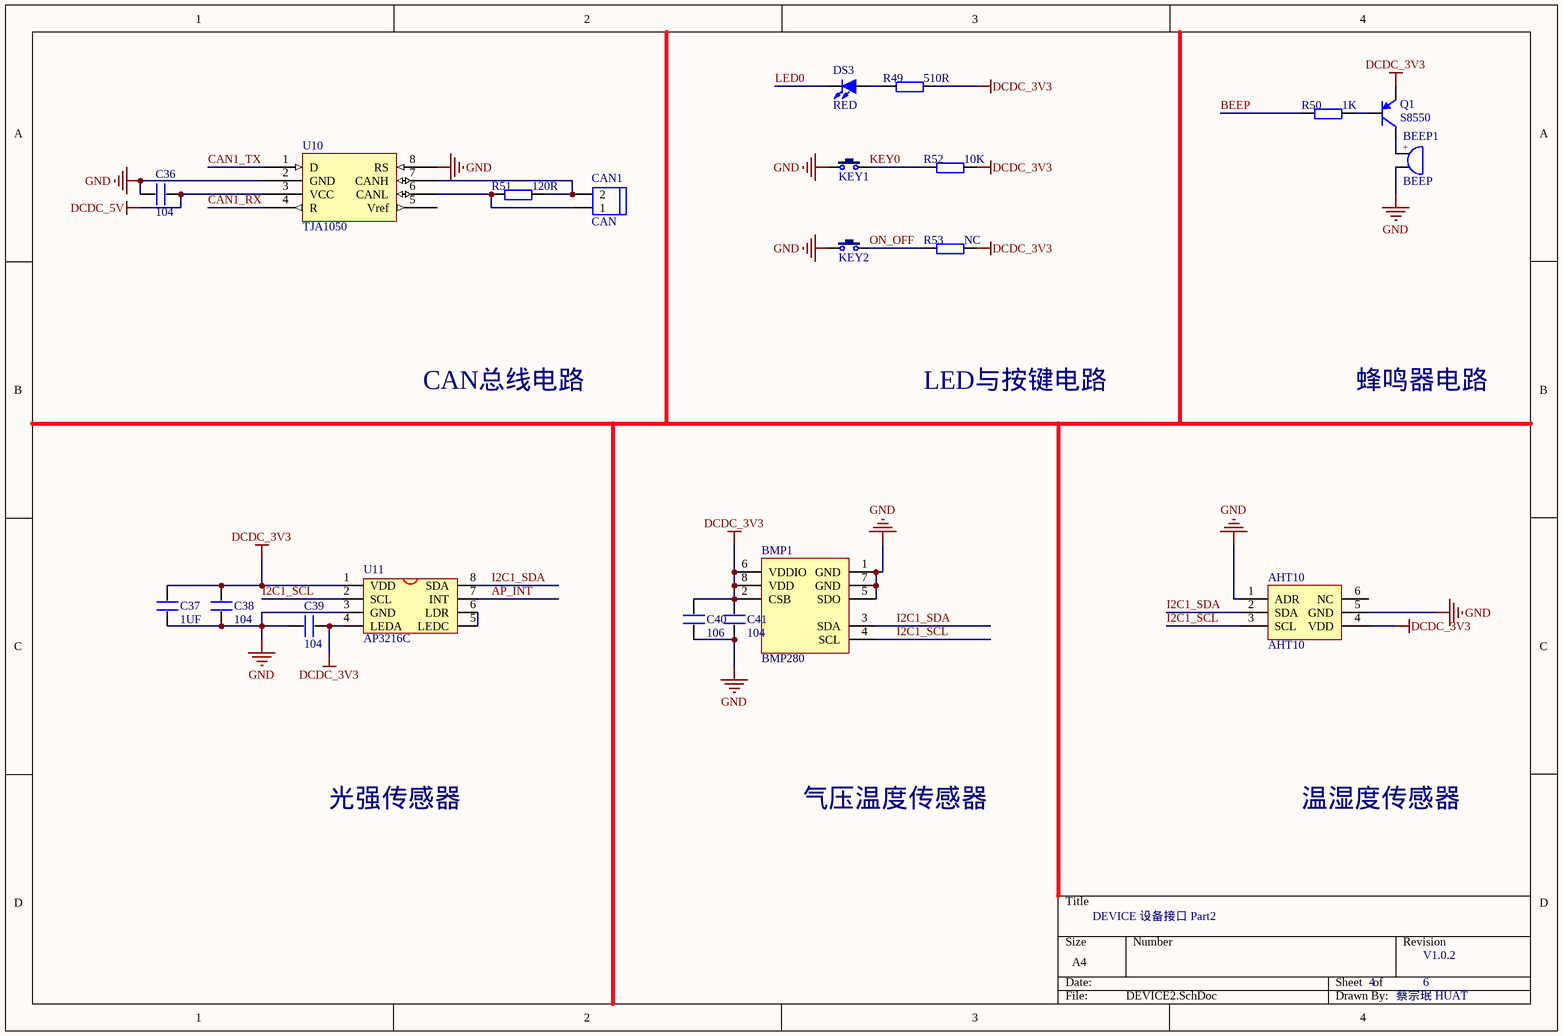
[diagram p4: DEVICE2.SchDoc]

### Parts
AHT10  AHT10  [AHT10 温湿度传感器]
BEEP1  BEEP  [BEEP 5x9x5.5]
BMP1  BMP280  [BMP280]
C36  104  [C_0603P]
C37  1UF  [C_0603P]
C38  104  [C_0603P]
C39  104  [C_0603P]
C40  106  [C_0603P]
C41  104  [C_0603P]
CAN1  CAN  [KF301-2P]
DS3  RED  [LED 0805R]
KEY1  KEY  [TSW DIP-6*6*5 - 2]  (value not drawn)
KEY2  KEY  [TSW DIP-6*6*5 - 2]  (value not drawn)
Q1  S8550  [SOT23-3L]
R49  510R  [R_0603P]
R50  1K  [R_0603P]
R51  120R  [R_0603P]
R52  10K  [R_0603P]
R53  NC  [R_0603P]
U10  TJA1050  [SOP8_N]
U11  AP3216C  [QFN8]

### Nets
DCDC_3V3: AHT10.4(VDD) BMP1.2(CSB) BMP1.6(VDDIO) BMP1.8(VDD) C37.2 C38.2 C39.2 C40.1 C41.1 Q1.2(E) R49.2 R52.2 R53.2 U11.1(VDD) U11.4(LEDA)
DCDC_5V: C36.2 U10.3(VCC)
GND: AHT10.1(ADR) AHT10.5(GND) BEEP1.2 BMP1.1(GND) BMP1.5(SDO) BMP1.7(GND) C36.1 C37.1 C38.1 C39.1 C40.2 C41.2 KEY1.1 KEY2.1 U10.2(GND) U10.8(RS) U11.3(GND)
AP_INT: U11.7(INT)
BEEP: R50.1
CAN1_RX: U10.4(R)
CAN1_TX: U10.1(D)
I2C1_SCL: AHT10.3(SCL) BMP1.4(SCL) U11.2(SCL)
I2C1_SDA: AHT10.2(SDA) BMP1.3(SDA) U11.8(SDA)
KEY0: KEY1.2 R52.1
LED0: DS3.2(K)
ON_OFF: KEY2.2 R53.1
NetBEEP1_1: BEEP1.1 Q1.3(C)
NetCAN1_1: CAN1.1 R51.1 U10.6(CANL)
NetCAN1_2: CAN1.2 R51.2 U10.7(CANH)
NetDS3_1: DS3.1(A) R49.1
NetQ1_1: Q1.1(B) R50.2
NetU11_5: U11.5(LEDC) U11.6(LDR)

Not connected (* = marked no-connect by the designer): AHT10 6(NC); U10 5(Vref)

### Notes on the sheet
- CAN总线电路
- LED与按键电路
- 蜂鸣器电路
- 光强传感器
- 气压温度传感器
- 温湿度传感器
- DEVICE 设备接口 Part2
- 4
- 6
- V1.0.2
- 蔡宗珉 HUAT
- (in symbol BEEP) +

### Library data of the parts
AHT10 = AHT10 温湿度传感器
BEEP1 = BEEP: 蜂鸣器; 版权归属: 源创客; BOM名称: 蜂鸣器; 学习资源: www.ooocke.com
C36-C41 = C
CAN1 = HEAD2
DS3 = LED-SMD: 贴片LED; 版权归属: 源创客; BOM名称: 贴片LED; 学习资源: www.ooocke.com
KEY1 KEY2 = KEY: 按键; BOM名称: 3x6轻触开关; 版权归属: 源创客; 学习资源: www.ooocke.com
Q1 = 8550-SMD: 高频放大-PNP型; 版权归属: 源创客; 属性: 40V 1.5A 1W 100MHZ; BOM名称: 高频放大-PNP型; 学习资源: www.ooocke.com
R49-R53 = R
U10 = SN65HVD230D
U11 = AP3216C: ALS+PS Sensor

## Nets that join several sheets
DCDC_3V3: CORE (20 pins), POWER (9 pins), DEVICE (23 pins), CONNECT (7 pins), DEVICE2 (15 pins)
DCDC_5V: CORE (C1.1 I.MX1.J2_1 I.MX1.J2_2 P2.46), POWER (9 pins), DEVICE (7 pins), CONNECT (5 pins), DEVICE2 (C36.2 U10.3)
GND: CORE (16 pins), POWER (36 pins), DEVICE (35 pins), CONNECT (31 pins), DEVICE2 (17 pins)
USB_OTG1_VBUS: CORE (I.MX1.J2_57), CONNECT (D6.2)
USB_OTG2_VBUS: CORE (I.MX1.J2_58), CONNECT (D7.2)
VDD_COIN_3V: CORE (I.MX1.J1_42), POWER (BAT1.1 C16.2)
VUSB: POWER (SW1.2), CONNECT (C24.2 U7.3 USB_TTL1.1)
AP_INT: CORE (I.MX1.J2_49 P2.7), DEVICE2 (U11.7)
BEEP: CORE (I.MX1.J2_5), DEVICE2 (R50.1)
BLT_PWM: CORE (I.MX1.J2_16 P2.13), DEVICE (R73.1 RGBLCD1.34)
BOOT_DATA7: CORE (BOOT_CFG1.9), DEVICE (U14.3)
CAN1_RX: CORE (I.MX1.J2_35 P2.17), DEVICE2 (U10.4)
CAN1_TX: CORE (I.MX1.J2_36 P2.19), DEVICE2 (U10.1)
CSI_DATA0: CORE (I.MX1.J1_56), DEVICE (CAMERA.8)
CSI_DATA1: CORE (I.MX1.J1_57), DEVICE (CAMERA.9)
CSI_DATA2: CORE (I.MX1.J1_3), DEVICE (CAMERA.10)
CSI_DATA3: CORE (I.MX1.J1_59), DEVICE (CAMERA.11)
CSI_DATA4: CORE (I.MX1.J1_55), DEVICE (CAMERA.12)
CSI_DATA5: CORE (I.MX1.J1_6), DEVICE (CAMERA.13)
CSI_DATA6: CORE (I.MX1.J1_4), DEVICE (CAMERA.14)
CSI_DATA7: CORE (I.MX1.J1_58), DEVICE (CAMERA.15)
CSI_HSYNC: CORE (I.MX1.J1_1), DEVICE (CAMERA.5)
CSI_MCLK: CORE (I.MX1.J1_2), DEVICE (CAMERA.17)
CSI_PIXCLK: CORE (I.MX1.J1_5), DEVICE (CAMERA.16)
CSI_PWDN: CORE (I.MX1.J2_14 P2.10), DEVICE (CAMERA.18 R62.2)
CSI_RESET: CORE (I.MX1.J2_13 P2.9), DEVICE (CAMERA.7 R54.2)
CSI_VSYNC: CORE (I.MX1.J1_60), DEVICE (CAMERA.3)
CT_INT: CORE (I.MX1.J2_15 P2.11), DEVICE (C51.1 R69.1 RGBLCD1.39)
CT_RST: CORE (I.MX1.J1_48), DEVICE (R72.1 RGBLCD1.35)
E22_AUX_SNVS_TAMPER4: CORE (I.MX1.J2_3 P2.1), DEVICE (JP2.5)
E22_M0_SNVS_TAMPER7: CORE (I.MX1.J2_10 P2.5), DEVICE (JP2.1)
E22_M1_SNVS_TAMPER5: CORE (I.MX1.J2_11 P2.6), DEVICE (JP2.3)
ENET1_RXD1: CORE (I.MX1.J2_24 P2.34), DEVICE (ATK_MODULE.2)
ENET1_TXD0: CORE (I.MX1.J2_23 P2.32), DEVICE (ATK_MODULE.1)
ENET2_CRS_DV: CORE (I.MX1.J1_33), CONNECT (U5.11)
ENET2_INT_TREE#: CORE (I.MX1.J1_39), CONNECT (R44.1 U5.14)
ENET2_RST: CORE (I.MX1.J2_9 P2.4), CONNECT (C30.2 R45.1 U5.15)
ENET2_RXD0: CORE (I.MX1.J1_38), CONNECT (U5.8)
ENET2_RXD1: CORE (I.MX1.J1_37), CONNECT (U5.7)
ENET2_RXER: CORE (I.MX1.J1_34), CONNECT (R43.1 U5.10)
ENET2_TX_CLK: CORE (I.MX1.J1_31), CONNECT (U5.5)
ENET2_TXD0: CORE (I.MX1.J1_36), CONNECT (U5.17)
ENET2_TXD1: CORE (I.MX1.J1_35), CONNECT (U5.18)
ENET2_TXEN: CORE (I.MX1.J1_32), CONNECT (U5.16)
ENET_MDC: CORE (R4.2), CONNECT (R39.1 U5.13)
ENET_MDIO: CORE (R5.2), CONNECT (R37.1 U5.12)
I2C1_SCL: CORE (I.MX1.J2_33 P2.43 R8.2), DEVICE2 (AHT10.3 BMP1.4 U11.2)
I2C1_SDA: CORE (I.MX1.J2_34 P2.45 R9.2), DEVICE2 (AHT10.2 BMP1.3 U11.8)
I2C2_SCL: CORE (I.MX1.J2_31 P2.42 R6.2), DEVICE (CAMERA.4 RGBLCD1.38)
I2C2_SDA: CORE (I.MX1.J2_32 P2.44 R7.2), DEVICE (CAMERA.6 RGBLCD1.36)
JTAG_MOD: CORE (I.MX1.J2_22 P2.31), DEVICE (R70.1 R71.2)
KEY0: CORE (I.MX1.J2_48), DEVICE2 (KEY1.2 R52.1)
LCD_B0: CORE (I.MX1.J1_7), DEVICE (RGBLCD1.21)
LCD_B1: CORE (I.MX1.J1_8), DEVICE (RGBLCD1.22)
LCD_B2: CORE (I.MX1.J1_9), DEVICE (RGBLCD1.23)
LCD_B3: CORE (BOOT_CFG1.13 I.MX1.J1_10), DEVICE (RGBLCD1.24)
LCD_B4: CORE (BOOT_CFG1.12 I.MX1.J1_11), DEVICE (RGBLCD1.25)
LCD_B5: CORE (BOOT_CFG1.11 I.MX1.J1_12), DEVICE (RGBLCD1.26)
LCD_B6: CORE (BOOT_CFG1.10 I.MX1.J1_13), DEVICE (RGBLCD1.27)
LCD_DATA7: CORE (I.MX1.J1_14), DEVICE (R68.1 U14.4)
LCD_DATA8: CORE (I.MX1.J1_15), DEVICE (RGBLCD1.12)
LCD_DATA9: CORE (I.MX1.J1_16), DEVICE (RGBLCD1.13)
LCD_DATA10: CORE (I.MX1.J1_17), DEVICE (RGBLCD1.14)
LCD_DATA11: CORE (BOOT_CFG1.14 I.MX1.J1_18), DEVICE (RGBLCD1.15)
LCD_DATA12: CORE (I.MX1.J1_19), DEVICE (RGBLCD1.16)
LCD_DATA13: CORE (I.MX1.J1_20), DEVICE (RGBLCD1.17)
LCD_DATA14: CORE (I.MX1.J1_21), DEVICE (RGBLCD1.18)
LCD_DATA15: CORE (I.MX1.J1_22), DEVICE (R66.1 U13.4)
LCD_DATA16: CORE (I.MX1.J1_23), DEVICE (RGBLCD1.3)
LCD_DATA17: CORE (I.MX1.J1_24), DEVICE (RGBLCD1.4)
LCD_DATA18: CORE (I.MX1.J1_25), DEVICE (RGBLCD1.5)
LCD_DATA19: CORE (I.MX1.J1_26), DEVICE (RGBLCD1.6)
LCD_DATA20: CORE (I.MX1.J1_27), DEVICE (RGBLCD1.7)
LCD_DATA21: CORE (I.MX1.J1_28), DEVICE (RGBLCD1.8)
LCD_DATA22: CORE (I.MX1.J1_29), DEVICE (RGBLCD1.9)
LCD_DATA23: CORE (I.MX1.J1_30), DEVICE (R67.1 U12.4)
LCD_DE: CORE (I.MX1.J1_46), DEVICE (R64.1 RGBLCD1.33)
LCD_HSYNC: CORE (I.MX1.J1_44), DEVICE (RGBLCD1.31)
LCD_PCLK: CORE (I.MX1.J1_45), DEVICE (RGBLCD1.30)
LCD_VSYNC: CORE (I.MX1.J1_43), DEVICE (R63.1 RGBLCD1.32)
LED0: CORE (I.MX1.J2_47), DEVICE2 (DS3.2)
ON_OFF: CORE (I.MX1.J2_4 P2.2), DEVICE2 (KEY2.2 R53.1)
PMIC_ON_REQ: CORE (I.MX1.J1_41), POWER (R21.2)
RESET: CORE (I.MX1.J1_40 R19.1), DEVICE (R58.1 RETSET.1 RGBLCD1.40)
UART1_RXD: CORE (I.MX1.J2_46 P2.14), CONNECT (U9.1)
UART1_TXD: CORE (I.MX1.J2_50 P2.12), CONNECT (U8.1)
UART3_RXD: CORE (I.MX1.J2_37 P2.35), DEVICE (UART3.4)
UART3_TXD: CORE (I.MX1.J2_38 P2.33), DEVICE (UART3.3)
USB_OTG1_DN: CORE (I.MX1.J2_53), CONNECT (USB_HOST2.2 USB_OTG1.2)
USB_OTG1_DP: CORE (I.MX1.J2_54), CONNECT (USB_HOST2.3 USB_OTG1.3)
USB_OTG1_ID: CORE (I.MX1.J2_51), CONNECT (R34.1 R35.2 USB_OTG1.4)
USB_OTG2_DN: CORE (I.MX1.J2_55), CONNECT (USB_HOST1.2)
USB_OTG2_DP: CORE (I.MX1.J2_56), CONNECT (USB_HOST1.3)
USDHC1_CD_B: CORE (I.MX1.J2_43 SDIO_WIFI.11), DEVICE (R61.1 TF_CARD1.9)
USDHC1_CLK: CORE (R1.2 SDIO_WIFI.8), DEVICE (TF_CARD1.5)
USDHC1_CMD: CORE (R2.2 SDIO_WIFI.7), DEVICE (R57.1 TF_CARD1.3)
USDHC1_DATA0: CORE (R3.8 SDIO_WIFI.3), DEVICE (R59.1 TF_CARD1.7)
USDHC1_DATA1: CORE (R3.6 SDIO_WIFI.4), DEVICE (R60.1 TF_CARD1.8)
USDHC1_DATA2: CORE (R3.2 SDIO_WIFI.5), DEVICE (R55.1 TF_CARD1.1)
USDHC1_DATA3: CORE (R3.4 SDIO_WIFI.6), DEVICE (R56.1 TF_CARD1.2)